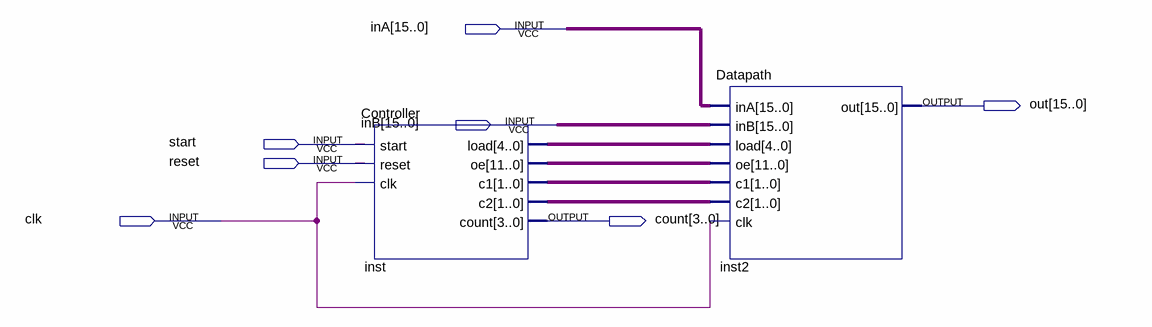
[diagram p0: schematic sheet]
// Quartus schematic Data_pipeline_Beha.bdf as structural Verilog: 2 symbols, 7 pins
module Data_pipeline_Beha (
  input  [15:0] inA,
  input  [15:0] inB,
  input  start,
  input  reset,
  input  clk,
  output [15:0] out,
  output [3:0] count
);

  wire [1:0] inst_c1, inst_c2;
  wire [4:0] inst_load;
  wire [11:0] inst_oe;

  Controller inst (
    .start(start), .reset(reset), .clk(clk), .load(inst_load), .oe(inst_oe), .c1(inst_c1), .c2(inst_c2),
    .count(count));
  Datapath inst2 (
    .inA(inA), .inB(inB), .load(inst_load), .oe(inst_oe), .c1(inst_c1), .c2(inst_c2), .clk(clk), .out(out));
endmodule
